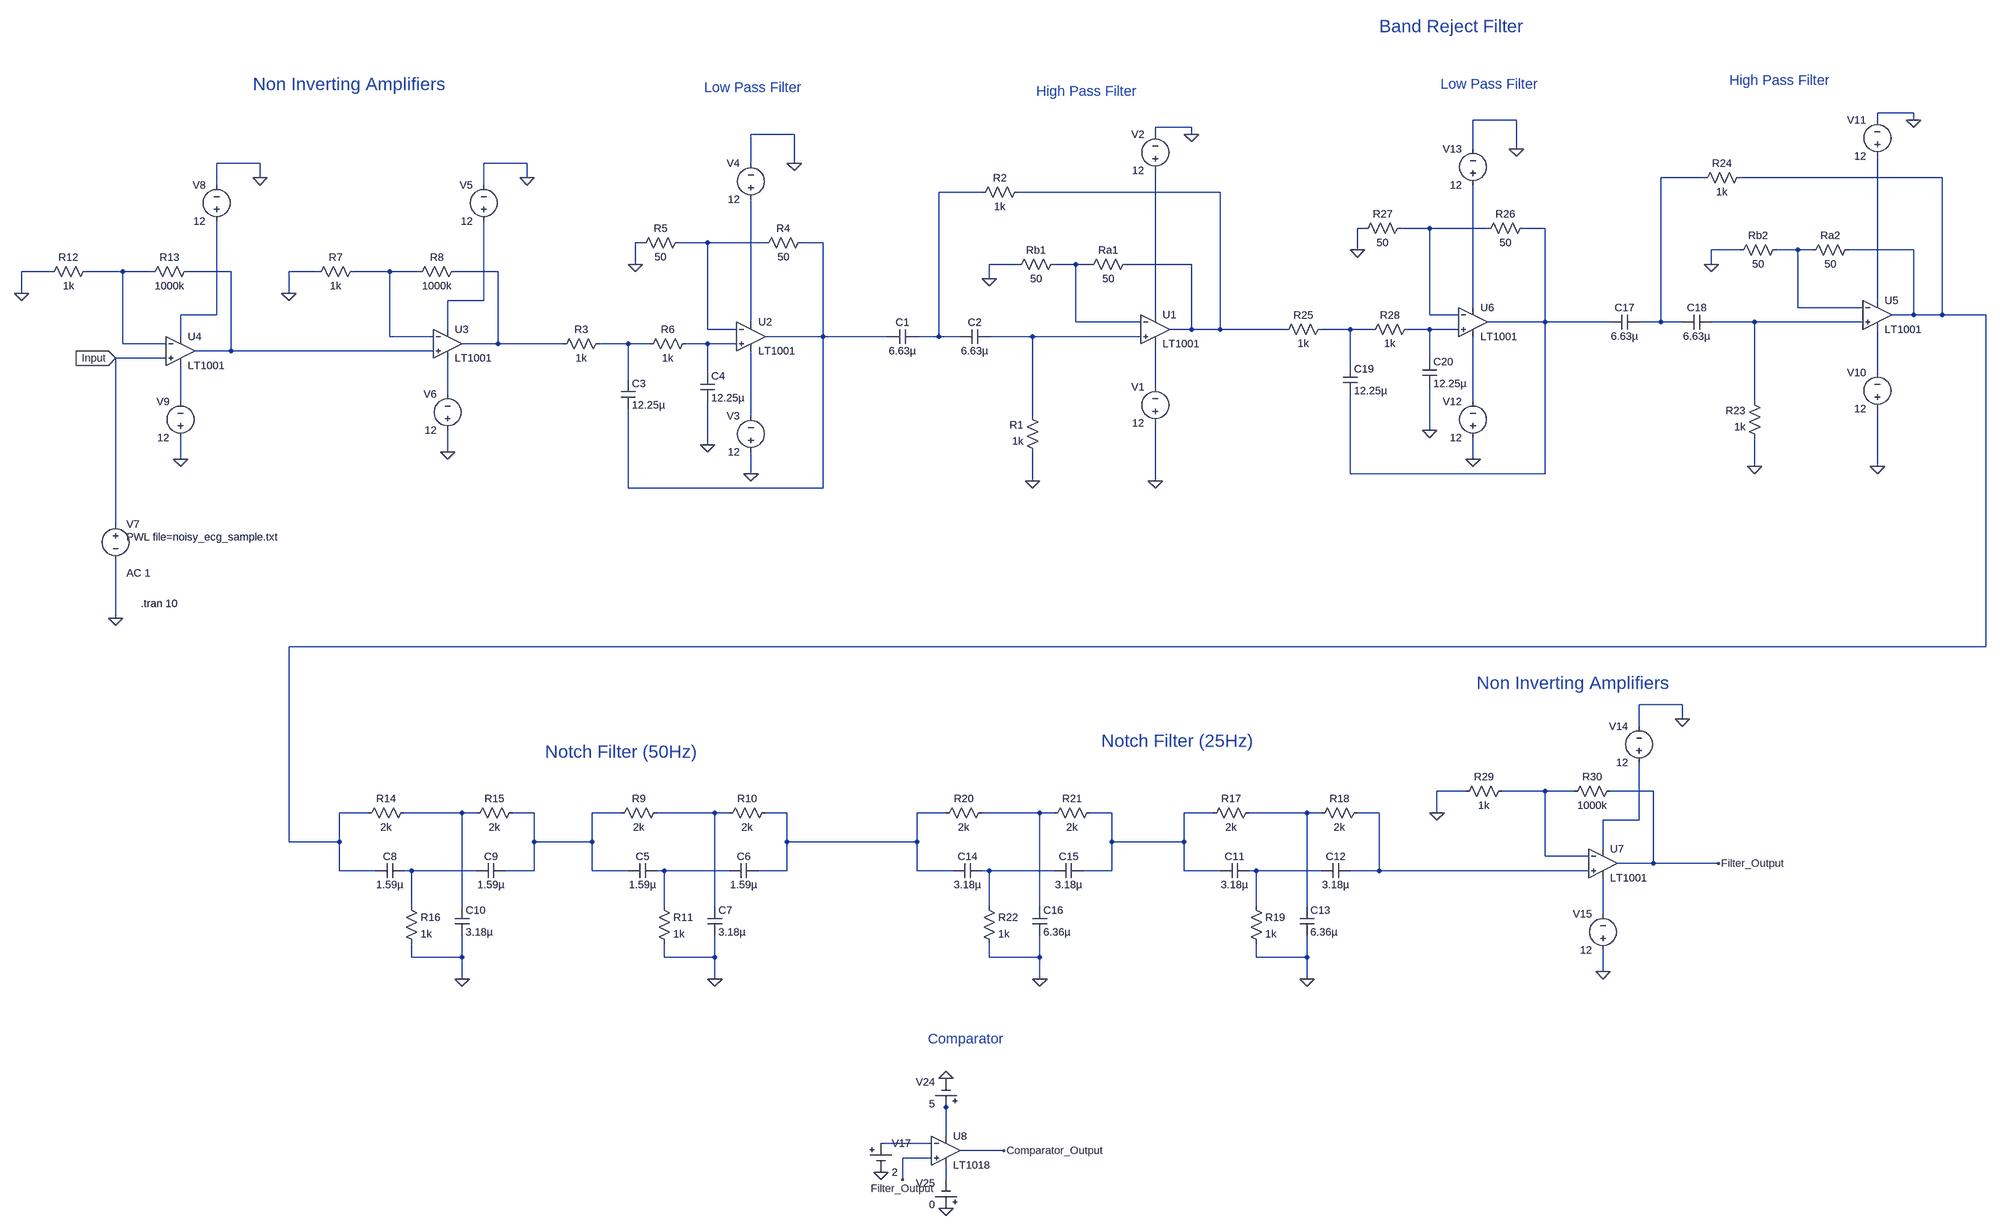
[diagram p0: schematic ECG denoising circuit_Team1.asc]
ECG denoising circuit_Team1.asc, the LTspice schematic file:
Version 4
SHEET 1 4928 3460
WIRE 880 -368 800 -368
WIRE 0 -352 -96 -352
WIRE 800 -352 800 -368
WIRE 880 -352 880 -368
WIRE -720 -336 -800 -336
WIRE -1600 -320 -1696 -320
WIRE -800 -320 -800 -336
WIRE -720 -320 -720 -336
WIRE -96 -288 -96 -352
WIRE 0 -288 0 -352
WIRE -2784 -256 -2880 -256
WIRE -2192 -256 -2288 -256
WIRE -1696 -256 -1696 -320
WIRE -1600 -256 -1600 -320
WIRE -2784 -224 -2784 -256
WIRE -2192 -224 -2192 -256
WIRE 416 -224 320 -224
WIRE 944 -224 496 -224
WIRE -2880 -208 -2880 -256
WIRE -2288 -208 -2288 -256
WIRE -1184 -192 -1280 -192
WIRE -656 -192 -1104 -192
WIRE -336 -112 -352 -112
WIRE -192 -112 -256 -112
WIRE -64 -112 -192 -112
WIRE 64 -112 16 -112
WIRE -1936 -80 -1952 -80
WIRE -1792 -80 -1856 -80
WIRE -1664 -80 -1792 -80
WIRE -1536 -80 -1584 -80
WIRE -352 -64 -352 -112
WIRE 496 -64 432 -64
WIRE 624 -64 576 -64
WIRE 656 -64 624 -64
WIRE 880 -64 736 -64
WIRE -1952 -32 -1952 -80
WIRE -1104 -32 -1168 -32
WIRE -976 -32 -1024 -32
WIRE -944 -32 -976 -32
WIRE -720 -32 -864 -32
WIRE 432 -32 432 -64
WIRE -3248 -16 -3312 -16
WIRE -3088 -16 -3168 -16
WIRE -3024 -16 -3088 -16
WIRE -2848 -16 -2944 -16
WIRE -2656 -16 -2720 -16
WIRE -2496 -16 -2576 -16
WIRE -2432 -16 -2496 -16
WIRE -2256 -16 -2352 -16
WIRE -1168 0 -1168 -32
WIRE -3312 32 -3312 -16
WIRE -2720 32 -2720 -16
WIRE -2288 48 -2288 -128
WIRE -2288 48 -2368 48
WIRE 800 48 800 -272
WIRE -96 64 -96 -208
WIRE 624 64 624 -64
WIRE 768 64 624 64
WIRE -2880 80 -2880 -128
WIRE -2880 80 -2960 80
WIRE -800 80 -800 -240
WIRE -192 80 -192 -112
WIRE -128 80 -192 80
WIRE 880 80 880 -64
WIRE 880 80 832 80
WIRE 944 80 944 -224
WIRE 944 80 880 80
WIRE 1040 80 944 80
WIRE -1696 96 -1696 -176
WIRE -976 96 -976 -32
WIRE -832 96 -976 96
WIRE 64 96 64 -112
WIRE 64 96 -64 96
WIRE 208 96 64 96
WIRE 320 96 320 -224
WIRE 320 96 272 96
WIRE 368 96 320 96
WIRE 528 96 432 96
WIRE 768 96 528 96
WIRE -2368 112 -2368 48
WIRE -1792 112 -1792 -80
WIRE -1728 112 -1792 112
WIRE -720 112 -720 -32
WIRE -720 112 -768 112
WIRE -656 112 -656 -192
WIRE -656 112 -720 112
WIRE -512 112 -656 112
WIRE -368 112 -432 112
WIRE -320 112 -368 112
WIRE -192 112 -240 112
WIRE -128 112 -192 112
WIRE -2960 128 -2960 80
WIRE -2496 128 -2496 -16
WIRE -2400 128 -2496 128
WIRE -1536 128 -1536 -80
WIRE -1536 128 -1664 128
WIRE -1392 128 -1536 128
WIRE -1280 128 -1280 -192
WIRE -1280 128 -1328 128
WIRE -1232 128 -1280 128
WIRE -1072 128 -1168 128
WIRE -832 128 -1072 128
WIRE -3088 144 -3088 -16
WIRE -2992 144 -3088 144
WIRE -2256 144 -2256 -16
WIRE -2256 144 -2336 144
WIRE -2112 144 -2256 144
WIRE -1968 144 -2032 144
WIRE -1920 144 -1968 144
WIRE -1792 144 -1840 144
WIRE -1728 144 -1792 144
WIRE -2848 160 -2848 -16
WIRE -2848 160 -2928 160
WIRE -2400 160 -2848 160
WIRE -2992 176 -3104 176
WIRE -192 176 -192 112
WIRE -368 192 -368 112
WIRE -1792 208 -1792 144
WIRE 800 208 800 112
WIRE -1968 224 -1968 144
WIRE -800 240 -800 144
WIRE -2368 256 -2368 176
WIRE -2960 272 -2960 192
WIRE -96 272 -96 128
WIRE 528 272 528 96
WIRE -1696 304 -1696 160
WIRE -1072 304 -1072 128
WIRE -192 336 -192 240
WIRE -1792 368 -1792 272
WIRE -2368 384 -2368 336
WIRE -2960 400 -2960 352
WIRE -96 400 -96 352
WIRE 528 416 528 352
WIRE 800 416 800 288
WIRE -1696 432 -1696 384
WIRE -368 432 -368 256
WIRE 64 432 64 96
WIRE 64 432 -368 432
WIRE -1072 448 -1072 384
WIRE -800 448 -800 320
WIRE -1968 464 -1968 288
WIRE -1536 464 -1536 128
WIRE -1536 464 -1968 464
WIRE -3104 544 -3104 176
WIRE -3104 752 -3104 624
WIRE 1040 816 1040 80
WIRE 1040 816 -2720 816
WIRE 368 944 272 944
WIRE 368 976 368 944
WIRE 272 992 272 944
WIRE -112 1136 -176 1136
WIRE 64 1136 -32 1136
WIRE 128 1136 64 1136
WIRE 304 1136 208 1136
WIRE -2544 1184 -2608 1184
WIRE -2336 1184 -2464 1184
WIRE -2304 1184 -2336 1184
WIRE -2176 1184 -2224 1184
WIRE -1984 1184 -2048 1184
WIRE -1776 1184 -1904 1184
WIRE -1744 1184 -1776 1184
WIRE -1616 1184 -1664 1184
WIRE -1264 1184 -1328 1184
WIRE -1056 1184 -1184 1184
WIRE -1024 1184 -1056 1184
WIRE -896 1184 -944 1184
WIRE -672 1184 -736 1184
WIRE -464 1184 -592 1184
WIRE -432 1184 -464 1184
WIRE -304 1184 -352 1184
WIRE -176 1184 -176 1136
WIRE 272 1200 272 1072
WIRE 272 1200 192 1200
WIRE -2720 1248 -2720 816
WIRE -2608 1248 -2608 1184
WIRE -2608 1248 -2720 1248
WIRE -2176 1248 -2176 1184
WIRE -2048 1248 -2048 1184
WIRE -2048 1248 -2176 1248
WIRE -1616 1248 -1616 1184
WIRE -1328 1248 -1328 1184
WIRE -1328 1248 -1616 1248
WIRE -896 1248 -896 1184
WIRE -736 1248 -736 1184
WIRE -736 1248 -896 1248
WIRE 192 1264 192 1200
WIRE 64 1280 64 1136
WIRE 160 1280 64 1280
WIRE 304 1296 304 1136
WIRE 304 1296 224 1296
WIRE 448 1296 304 1296
WIRE -2608 1312 -2608 1248
WIRE -2528 1312 -2608 1312
WIRE -2448 1312 -2464 1312
WIRE -2304 1312 -2448 1312
WIRE -2176 1312 -2176 1248
WIRE -2176 1312 -2240 1312
WIRE -2048 1312 -2048 1248
WIRE -1968 1312 -2048 1312
WIRE -1888 1312 -1904 1312
WIRE -1744 1312 -1888 1312
WIRE -1616 1312 -1616 1248
WIRE -1616 1312 -1680 1312
WIRE -1328 1312 -1328 1248
WIRE -1248 1312 -1328 1312
WIRE -1168 1312 -1184 1312
WIRE -1024 1312 -1168 1312
WIRE -896 1312 -896 1248
WIRE -896 1312 -960 1312
WIRE -736 1312 -736 1248
WIRE -656 1312 -736 1312
WIRE -576 1312 -592 1312
WIRE -432 1312 -576 1312
WIRE -304 1312 -304 1184
WIRE -304 1312 -368 1312
WIRE 160 1312 -304 1312
WIRE -2448 1392 -2448 1312
WIRE -2336 1392 -2336 1184
WIRE -1888 1392 -1888 1312
WIRE -1776 1392 -1776 1184
WIRE -1168 1392 -1168 1312
WIRE -1056 1392 -1056 1184
WIRE -576 1392 -576 1312
WIRE -464 1392 -464 1184
WIRE 192 1408 192 1328
WIRE -2448 1504 -2448 1472
WIRE -2336 1504 -2336 1456
WIRE -2336 1504 -2448 1504
WIRE -1888 1504 -1888 1472
WIRE -1776 1504 -1776 1456
WIRE -1776 1504 -1888 1504
WIRE -1168 1504 -1168 1472
WIRE -1056 1504 -1056 1456
WIRE -1056 1504 -1168 1504
WIRE -576 1504 -576 1472
WIRE -464 1504 -464 1456
WIRE -464 1504 -576 1504
WIRE 192 1536 192 1488
WIRE -2336 1552 -2336 1504
WIRE -1776 1552 -1776 1504
WIRE -1056 1552 -1056 1504
WIRE -464 1552 -464 1504
WIRE -1264 2080 -1264 2064
WIRE -1264 2144 -1264 2080
WIRE -1296 2160 -1408 2160
WIRE -1136 2176 -1232 2176
WIRE -1296 2192 -1360 2192
WIRE -1360 2240 -1360 2192
WIRE -1264 2240 -1264 2208
FLAG -1072 448 0
FLAG -1168 0 0
FLAG -720 -320 0
FLAG -800 448 0
FLAG -1952 -32 0
FLAG -1792 368 0
FLAG -1696 432 0
FLAG -1600 -256 0
FLAG -2720 32 0
FLAG -2368 384 0
FLAG -2192 -224 0
FLAG -1776 1552 0
FLAG -3104 752 0
FLAG -3312 32 0
FLAG -2960 400 0
FLAG -2784 -224 0
FLAG -2336 1552 0
FLAG -464 1552 0
FLAG -1056 1552 0
FLAG 528 416 0
FLAG 432 -32 0
FLAG 880 -352 0
FLAG 800 416 0
FLAG -352 -64 0
FLAG -192 336 0
FLAG -96 400 0
FLAG 0 -288 0
FLAG -176 1184 0
FLAG 192 1536 0
FLAG 368 976 0
FLAG -3104 176 Input
IOPIN -3104 176 In
FLAG -1408 2224 0
FLAG -1264 2016 0
FLAG -1264 2304 0
FLAG -1136 2176 Comparator_Output
FLAG 448 1296 Filter_Output
FLAG -1360 2240 Filter_Output
SYMBOL cap -1328 112 R90
WINDOW 0 0 32 VBottom 2
WINDOW 3 32 32 VTop 2
SYMATTR InstName C1
SYMATTR Value 6.63µ
SYMBOL cap -1168 112 R90
WINDOW 0 0 32 VBottom 2
WINDOW 3 32 32 VTop 2
SYMATTR InstName C2
SYMATTR Value 6.63µ
SYMBOL res -1056 400 R180
WINDOW 0 36 76 Left 2
WINDOW 3 36 40 Left 2
SYMATTR InstName R1
SYMATTR Value 1k
SYMBOL OpAmps\\LT1001 -800 48 R0
SYMATTR InstName U1
SYMBOL res -848 -48 R90
WINDOW 0 0 56 VBottom 2
WINDOW 3 32 56 VTop 2
SYMATTR InstName Ra1
SYMATTR Value 50
SYMBOL res -1008 -48 R90
WINDOW 0 0 56 VBottom 2
WINDOW 3 32 56 VTop 2
SYMATTR InstName Rb1
SYMATTR Value 50
SYMBOL res -1088 -208 R90
WINDOW 0 0 56 VBottom 2
WINDOW 3 32 56 VTop 2
SYMATTR InstName R2
SYMATTR Value 1k
SYMBOL voltage -800 336 R180
WINDOW 0 24 96 Left 2
WINDOW 3 24 16 Left 2
WINDOW 123 0 0 Left 0
WINDOW 39 0 0 Left 0
SYMATTR InstName V1
SYMATTR Value 12
SYMBOL voltage -800 -224 R180
WINDOW 0 24 96 Left 2
WINDOW 3 24 16 Left 2
WINDOW 123 0 0 Left 0
WINDOW 39 0 0 Left 0
SYMATTR InstName V2
SYMATTR Value 12
SYMBOL OpAmps\\LT1001 -1696 64 R0
SYMATTR InstName U2
SYMBOL res -2016 128 R90
WINDOW 0 0 56 VBottom 2
WINDOW 3 32 56 VTop 2
SYMATTR InstName R3
SYMATTR Value 1k
SYMBOL res -1568 -96 R90
WINDOW 0 0 56 VBottom 2
WINDOW 3 32 56 VTop 2
SYMATTR InstName R4
SYMATTR Value 50
SYMBOL res -1840 -96 R90
WINDOW 0 0 56 VBottom 2
WINDOW 3 32 56 VTop 2
SYMATTR InstName R5
SYMATTR Value 50
SYMBOL res -1824 128 R90
WINDOW 0 0 56 VBottom 2
WINDOW 3 32 56 VTop 2
SYMATTR InstName R6
SYMATTR Value 1k
SYMBOL cap -1984 224 R0
SYMATTR InstName C3
SYMATTR Value 12.25µ
SYMBOL cap -1808 208 R0
SYMATTR InstName C4
SYMATTR Value 12.25µ
SYMBOL voltage -1696 400 R180
WINDOW 0 24 96 Left 2
WINDOW 3 24 16 Left 2
WINDOW 123 0 0 Left 0
WINDOW 39 0 0 Left 0
SYMATTR InstName V3
SYMATTR Value 12
SYMBOL voltage -1696 -160 R180
WINDOW 0 24 96 Left 2
WINDOW 3 24 16 Left 2
WINDOW 123 0 0 Left 0
WINDOW 39 0 0 Left 0
SYMATTR InstName V4
SYMATTR Value 12
SYMBOL OpAmps\\LT1001 -2368 80 R0
SYMATTR InstName U3
SYMBOL res -2560 -32 R90
WINDOW 0 0 56 VBottom 2
WINDOW 3 32 56 VTop 2
SYMATTR InstName R7
SYMATTR Value 1k
SYMBOL res -2336 -32 R90
WINDOW 0 0 56 VBottom 2
WINDOW 3 32 56 VTop 2
SYMATTR InstName R8
SYMATTR Value 1000k
SYMBOL voltage -2288 -112 R180
WINDOW 0 24 96 Left 2
WINDOW 3 24 16 Left 2
WINDOW 123 0 0 Left 0
WINDOW 39 0 0 Left 0
SYMATTR InstName V5
SYMATTR Value 12
SYMBOL voltage -2368 352 R180
WINDOW 0 24 96 Left 2
WINDOW 3 24 16 Left 2
WINDOW 123 0 0 Left 0
WINDOW 39 0 0 Left 0
SYMATTR InstName V6
SYMATTR Value 12
SYMBOL res -1888 1168 R90
WINDOW 0 0 56 VBottom 2
WINDOW 3 32 56 VTop 2
SYMATTR InstName R9
SYMATTR Value 2k
SYMBOL res -1648 1168 R90
WINDOW 0 0 56 VBottom 2
WINDOW 3 32 56 VTop 2
SYMATTR InstName R10
SYMATTR Value 2k
SYMBOL cap -1904 1296 R90
WINDOW 0 0 32 VBottom 2
WINDOW 3 32 32 VTop 2
SYMATTR InstName C5
SYMATTR Value 1.59µ
SYMBOL cap -1680 1296 R90
WINDOW 0 0 32 VBottom 2
WINDOW 3 32 32 VTop 2
SYMATTR InstName C6
SYMATTR Value 1.59µ
SYMBOL cap -1792 1392 R0
SYMATTR InstName C7
SYMATTR Value 3.18µ
SYMBOL res -1904 1376 R0
SYMATTR InstName R11
SYMATTR Value 1k
SYMBOL voltage -3104 528 R0
WINDOW 123 24 124 Left 2
WINDOW 39 0 0 Left 0
WINDOW 3 24 44 Left 2
SYMATTR Value2 AC 1
SYMATTR Value PWL file=noisy_ecg_sample.txt
SYMATTR InstName V7
SYMBOL OpAmps\\LT1001 -2960 96 R0
SYMATTR InstName U4
SYMBOL res -3152 -32 R90
WINDOW 0 0 56 VBottom 2
WINDOW 3 32 56 VTop 2
SYMATTR InstName R12
SYMATTR Value 1k
SYMBOL res -2928 -32 R90
WINDOW 0 0 56 VBottom 2
WINDOW 3 32 56 VTop 2
SYMATTR InstName R13
SYMATTR Value 1000k
SYMBOL voltage -2880 -112 R180
WINDOW 0 24 96 Left 2
WINDOW 3 24 16 Left 2
WINDOW 123 0 0 Left 0
WINDOW 39 0 0 Left 0
SYMATTR InstName V8
SYMATTR Value 12
SYMBOL voltage -2960 368 R180
WINDOW 0 24 96 Left 2
WINDOW 3 24 16 Left 2
WINDOW 123 0 0 Left 0
WINDOW 39 0 0 Left 0
SYMATTR InstName V9
SYMATTR Value 12
SYMBOL res -2448 1168 R90
WINDOW 0 0 56 VBottom 2
WINDOW 3 32 56 VTop 2
SYMATTR InstName R14
SYMATTR Value 2k
SYMBOL res -2208 1168 R90
WINDOW 0 0 56 VBottom 2
WINDOW 3 32 56 VTop 2
SYMATTR InstName R15
SYMATTR Value 2k
SYMBOL cap -2464 1296 R90
WINDOW 0 0 32 VBottom 2
WINDOW 3 32 32 VTop 2
SYMATTR InstName C8
SYMATTR Value 1.59µ
SYMBOL cap -2240 1296 R90
WINDOW 0 0 32 VBottom 2
WINDOW 3 32 32 VTop 2
SYMATTR InstName C9
SYMATTR Value 1.59µ
SYMBOL cap -2352 1392 R0
SYMATTR InstName C10
SYMATTR Value 3.18µ
SYMBOL res -2464 1376 R0
SYMATTR InstName R16
SYMATTR Value 1k
SYMBOL res -576 1168 R90
WINDOW 0 0 56 VBottom 2
WINDOW 3 32 56 VTop 2
SYMATTR InstName R17
SYMATTR Value 2k
SYMBOL res -336 1168 R90
WINDOW 0 0 56 VBottom 2
WINDOW 3 32 56 VTop 2
SYMATTR InstName R18
SYMATTR Value 2k
SYMBOL cap -592 1296 R90
WINDOW 0 0 32 VBottom 2
WINDOW 3 32 32 VTop 2
SYMATTR InstName C11
SYMATTR Value 3.18µ
SYMBOL cap -368 1296 R90
WINDOW 0 0 32 VBottom 2
WINDOW 3 32 32 VTop 2
SYMATTR InstName C12
SYMATTR Value 3.18µ
SYMBOL cap -480 1392 R0
SYMATTR InstName C13
SYMATTR Value 6.36µ
SYMBOL res -592 1376 R0
SYMATTR InstName R19
SYMATTR Value 1k
SYMBOL res -1168 1168 R90
WINDOW 0 0 56 VBottom 2
WINDOW 3 32 56 VTop 2
SYMATTR InstName R20
SYMATTR Value 2k
SYMBOL res -928 1168 R90
WINDOW 0 0 56 VBottom 2
WINDOW 3 32 56 VTop 2
SYMATTR InstName R21
SYMATTR Value 2k
SYMBOL cap -1184 1296 R90
WINDOW 0 0 32 VBottom 2
WINDOW 3 32 32 VTop 2
SYMATTR InstName C14
SYMATTR Value 3.18µ
SYMBOL cap -960 1296 R90
WINDOW 0 0 32 VBottom 2
WINDOW 3 32 32 VTop 2
SYMATTR InstName C15
SYMATTR Value 3.18µ
SYMBOL cap -1072 1392 R0
SYMATTR InstName C16
SYMATTR Value 6.36µ
SYMBOL res -1184 1376 R0
SYMATTR InstName R22
SYMATTR Value 1k
SYMBOL cap 272 80 R90
WINDOW 0 0 32 VBottom 2
WINDOW 3 32 32 VTop 2
SYMATTR InstName C17
SYMATTR Value 6.63µ
SYMBOL cap 432 80 R90
WINDOW 0 0 32 VBottom 2
WINDOW 3 32 32 VTop 2
SYMATTR InstName C18
SYMATTR Value 6.63µ
SYMBOL res 544 368 R180
WINDOW 0 36 76 Left 2
WINDOW 3 36 40 Left 2
SYMATTR InstName R23
SYMATTR Value 1k
SYMBOL OpAmps\\LT1001 800 16 R0
SYMATTR InstName U5
SYMBOL res 752 -80 R90
WINDOW 0 0 56 VBottom 2
WINDOW 3 32 56 VTop 2
SYMATTR InstName Ra2
SYMATTR Value 50
SYMBOL res 592 -80 R90
WINDOW 0 0 56 VBottom 2
WINDOW 3 32 56 VTop 2
SYMATTR InstName Rb2
SYMATTR Value 50
SYMBOL res 512 -240 R90
WINDOW 0 0 56 VBottom 2
WINDOW 3 32 56 VTop 2
SYMATTR InstName R24
SYMATTR Value 1k
SYMBOL voltage 800 304 R180
WINDOW 0 24 96 Left 2
WINDOW 3 24 16 Left 2
WINDOW 123 0 0 Left 0
WINDOW 39 0 0 Left 0
SYMATTR InstName V10
SYMATTR Value 12
SYMBOL voltage 800 -256 R180
WINDOW 0 24 96 Left 2
WINDOW 3 24 16 Left 2
WINDOW 123 0 0 Left 0
WINDOW 39 0 0 Left 0
SYMATTR InstName V11
SYMATTR Value 12
SYMBOL OpAmps\\LT1001 -96 32 R0
SYMATTR InstName U6
SYMBOL res -416 96 R90
WINDOW 0 0 56 VBottom 2
WINDOW 3 32 56 VTop 2
SYMATTR InstName R25
SYMATTR Value 1k
SYMBOL res 32 -128 R90
WINDOW 0 0 56 VBottom 2
WINDOW 3 32 56 VTop 2
SYMATTR InstName R26
SYMATTR Value 50
SYMBOL res -240 -128 R90
WINDOW 0 0 56 VBottom 2
WINDOW 3 32 56 VTop 2
SYMATTR InstName R27
SYMATTR Value 50
SYMBOL res -224 96 R90
WINDOW 0 0 56 VBottom 2
WINDOW 3 32 56 VTop 2
SYMATTR InstName R28
SYMATTR Value 1k
SYMBOL cap -384 192 R0
SYMATTR InstName C19
SYMATTR Value 12.25µ
SYMBOL cap -208 176 R0
SYMATTR InstName C20
SYMATTR Value 12.25µ
SYMBOL voltage -96 368 R180
WINDOW 0 24 96 Left 2
WINDOW 3 24 16 Left 2
WINDOW 123 0 0 Left 0
WINDOW 39 0 0 Left 0
SYMATTR InstName V12
SYMATTR Value 12
SYMBOL voltage -96 -192 R180
WINDOW 0 24 96 Left 2
WINDOW 3 24 16 Left 2
WINDOW 123 0 0 Left 0
WINDOW 39 0 0 Left 0
SYMATTR InstName V13
SYMATTR Value 12
SYMBOL OpAmps\\LT1001 192 1232 R0
SYMATTR InstName U7
SYMBOL res -16 1120 R90
WINDOW 0 0 56 VBottom 2
WINDOW 3 32 56 VTop 2
SYMATTR InstName R29
SYMATTR Value 1k
SYMBOL res 224 1120 R90
WINDOW 0 0 56 VBottom 2
WINDOW 3 32 56 VTop 2
SYMATTR InstName R30
SYMATTR Value 1000k
SYMBOL voltage 272 1088 R180
WINDOW 0 24 96 Left 2
WINDOW 3 24 16 Left 2
WINDOW 123 0 0 Left 0
WINDOW 39 0 0 Left 0
SYMATTR InstName V14
SYMATTR Value 12
SYMBOL voltage 192 1504 R180
WINDOW 0 24 96 Left 2
WINDOW 3 24 16 Left 2
WINDOW 123 0 0 Left 0
WINDOW 39 0 0 Left 0
SYMATTR InstName V15
SYMATTR Value 12
SYMBOL Comparators\\LT1018 -1264 2176 R0
SYMATTR InstName U8
SYMBOL Misc\\cell -1408 2160 R0
WINDOW 123 0 0 Left 0
WINDOW 39 0 0 Left 0
SYMATTR InstName V17
SYMATTR Value 2
SYMBOL Misc\\cell -1264 2080 R180
WINDOW 0 24 56 Left 2
WINDOW 3 24 8 Left 2
WINDOW 123 0 0 Left 0
WINDOW 39 0 0 Left 0
SYMATTR InstName V24
SYMATTR Value 5
SYMBOL Misc\\cell -1264 2304 R180
WINDOW 0 24 56 Left 2
WINDOW 3 24 8 Left 2
WINDOW 123 0 0 Left 0
WINDOW 39 0 0 Left 0
SYMATTR InstName V25
SYMATTR Value 0
TEXT -3048 720 Left 2 !.tran 10
TEXT -2800 -432 Left 4 ;Non Inverting Amplifiers
TEXT -168 -432 Left 3 ;Low Pass Filter
TEXT -1064 -416 Left 3 ;High Pass Filter
TEXT -144 -560 Center 4 ;Band Reject Filter
TEXT -2152 1048 Left 4 ;Notch Filter (50Hz)
TEXT -920 1024 Left 4 ;Notch Filter (25Hz)
TEXT -88 896 Left 4 ;Non Inverting Amplifiers
TEXT -1304 1928 Left 3 ;Comparator
TEXT 472 -440 Left 3 ;High Pass Filter
TEXT -1800 -424 Left 3 ;Low Pass Filter

The netlist it stands for:
* ECG denoising circuit_Team1.asc
C1 N003 N008 6.63µ
C2 N024 N003 6.63µ
R1 0 N024 1k
XU1 N024 N010 N019 N028 N004 LT1001  ; pins In+ In- V+ V- OUT
Ra1 N004 N010 50
Rb1 N010 0 50
R2 N004 N003 1k
V1 0 N028 12
V2 N019 0 12
XU2 N026 N007 N020 N032 N008 LT1001  ; pins In+ In- V+ V- OUT
R3 N025 N014 1k
R4 N008 N007 50
R5 N007 0 50
R6 N026 N025 1k
C3 N025 N008 12.25µ
C4 N026 0 12.25µ
V3 0 N032 12
V4 N020 0 12
XU3 N012 N013 N015 N029 N014 LT1001  ; pins In+ In- V+ V- OUT
R7 N013 0 1k
R8 N014 N013 1000k
V5 N015 0 12
V6 0 N029 12
R9 N036 N035 2k
R10 N037 N036 2k
C5 N044 N035 1.59µ
C6 N037 N044 1.59µ
C7 N036 0 3.18µ
R11 N044 0 1k
V7 Input 0 PWL file=noisy_ecg_sample.txt AC 1
XU4 Input N011 N018 N030 N012 LT1001  ; pins In+ In- V+ V- OUT
R12 N011 0 1k
R13 N012 N011 1000k
V8 N018 0 12
V9 0 N030 12
R14 N034 N002 2k
R15 N035 N034 2k
C8 N043 N002 1.59µ
C9 N035 N043 1.59µ
C10 N034 0 3.18µ
R16 N043 0 1k
R17 N040 N039 2k
R18 N041 N040 2k
C11 N046 N039 3.18µ
C12 N041 N046 3.18µ
C13 N040 0 6.36µ
R19 N046 0 1k
R20 N038 N037 2k
R21 N039 N038 2k
C14 N045 N037 3.18µ
C15 N039 N045 3.18µ
C16 N038 0 6.36µ
R22 N045 0 1k
C17 N001 N006 6.63µ
C18 N021 N001 6.63µ
R23 0 N021 1k
XU5 N021 N009 N016 N027 N002 LT1001  ; pins In+ In- V+ V- OUT
Ra2 N002 N009 50
Rb2 N009 0 50
R24 N002 N001 1k
V10 0 N027 12
V11 N016 0 12
XU6 N023 N005 N017 N031 N006 LT1001  ; pins In+ In- V+ V- OUT
R25 N022 N004 1k
R26 N006 N005 50
R27 N005 0 50
R28 N023 N022 1k
C19 N022 N006 12.25µ
C20 N023 0 12.25µ
V12 0 N031 12
V13 N017 0 12
XU7 N041 N033 N042 N047 Filter_Output LT1001  ; pins In+ In- V+ V- OUT
R29 N033 0 1k
R30 Filter_Output N033 1000k
V14 N042 0 12
V15 0 N047 12
XU8 Filter_Output N049 N048 N050 Comparator_Output LT1018  ; pins In+ In- V+ V- OUT
V17 N049 0 2
V24 N048 0 5
V25 0 N050 0
.tran 10
* Non Inverting Amplifiers
* Low Pass Filter
* High Pass Filter
* Band Reject Filter
* Notch Filter (50Hz)
* Notch Filter (25Hz)
* Non Inverting Amplifiers
* Comparator
* High Pass Filter
* Low Pass Filter
.lib LTC.lib
.lib LTC1.lib
.backanno
.end